# EAGLE design Nakaya Schematic4-handrouting (EAGLE 9.6.2)
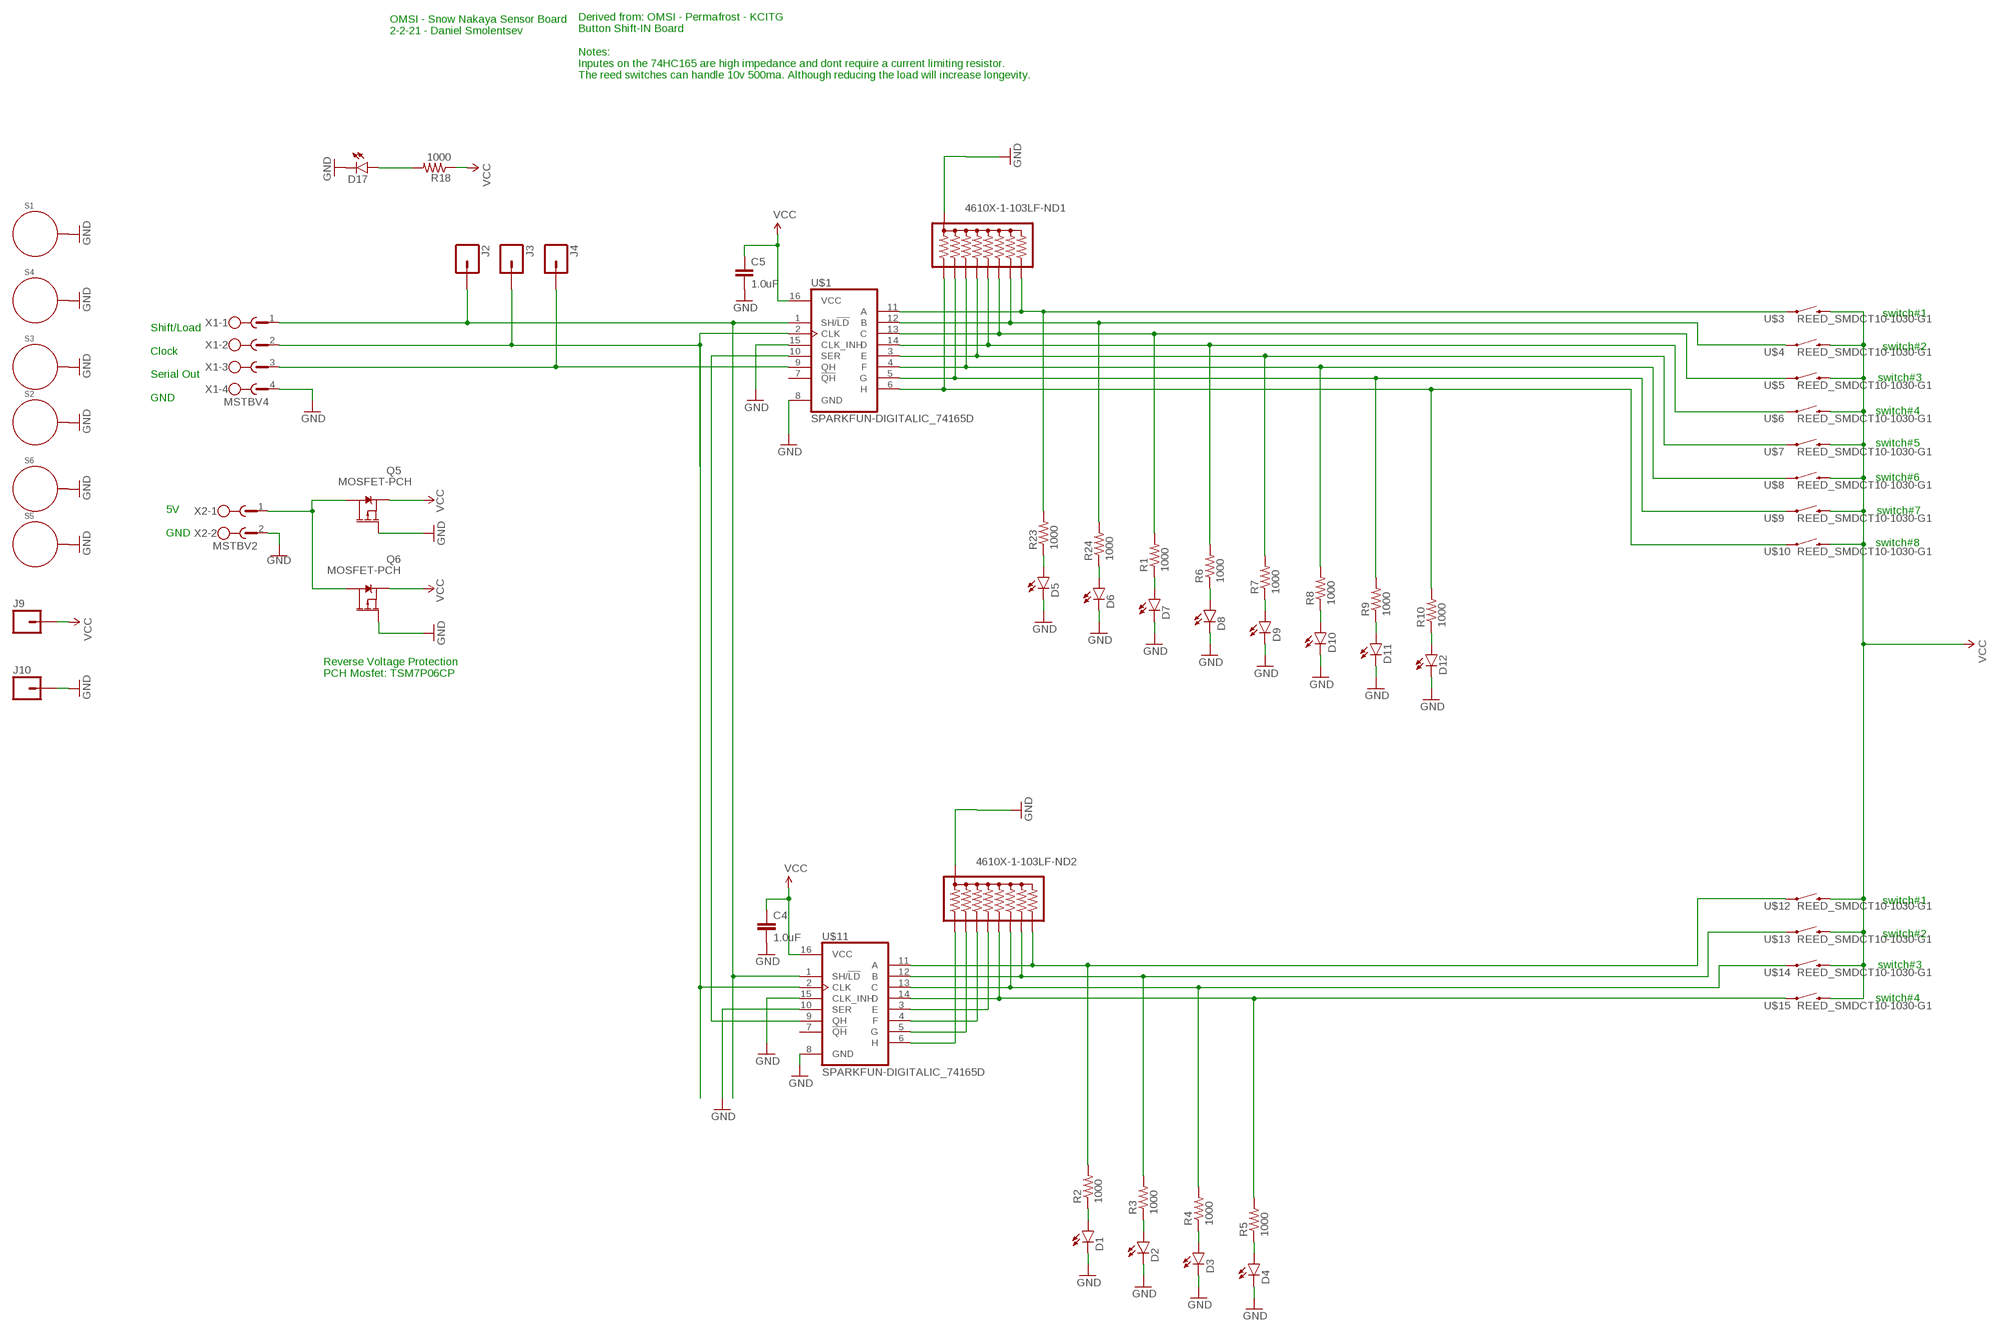
[diagram p0: schematic, sheet 1]

## Parts
4610X-1-103LF-ND1  RPACK-BUSSED-8-SIP-PTH-8  [RPACK-SIP-PTH-8]
4610X-1-103LF-ND2  RPACK-BUSSED-8-SIP-PTH-8  [RPACK-SIP-PTH-8]
C4  1.0uF  SPARKFUN-CAPACITORS_1.0UF-0805-25V-10%  [SPARKFUN-CAPACITORS_0805]
C5  1.0uF  SPARKFUN-CAPACITORS_1.0UF-0805-25V-10%  [SPARKFUN-CAPACITORS_0805]
D1  SPARKFUN-LED_LED1206  [SPARKFUN-LED_LED-1206]
D2  SPARKFUN-LED_LED1206  [SPARKFUN-LED_LED-1206]
D3  SPARKFUN-LED_LED1206  [SPARKFUN-LED_LED-1206]
D4  SPARKFUN-LED_LED1206  [SPARKFUN-LED_LED-1206]
D5  SPARKFUN-LED_LED1206  [SPARKFUN-LED_LED-1206]
D6  SPARKFUN-LED_LED1206  [SPARKFUN-LED_LED-1206]
D7  SPARKFUN-LED_LED1206  [SPARKFUN-LED_LED-1206]
D8  SPARKFUN-LED_LED1206  [SPARKFUN-LED_LED-1206]
D9  SPARKFUN-LED_LED1206  [SPARKFUN-LED_LED-1206]
D10  SPARKFUN-LED_LED1206  [SPARKFUN-LED_LED-1206]
D11  SPARKFUN-LED_LED1206  [SPARKFUN-LED_LED-1206]
D12  SPARKFUN-LED_LED1206  [SPARKFUN-LED_LED-1206]
D17  SPARKFUN-LED_LED1206  [SPARKFUN-LED_LED-1206]
J2  SPARKFUN-CONNECTORS_M01PTH_NO_SILK_YES_STOP  [SPARKFUN-CONNECTORS_1X01_NO_SILK]
J3  SPARKFUN-CONNECTORS_M01PTH_NO_SILK_YES_STOP  [SPARKFUN-CONNECTORS_1X01_NO_SILK]
J4  SPARKFUN-CONNECTORS_M01PTH_NO_SILK_YES_STOP  [SPARKFUN-CONNECTORS_1X01_NO_SILK]
J9  SPARKFUN-CONNECTORS_M01PTH_NO_SILK_YES_STOP  [SPARKFUN-CONNECTORS_1X01_NO_SILK]
J10  SPARKFUN-CONNECTORS_M01PTH_NO_SILK_YES_STOP  [SPARKFUN-CONNECTORS_1X01_NO_SILK]
Q5  MOSFET-PCH  [DPAK]
Q6  MOSFET-PCH  [DPAK]
R1  1000  SPARKFUN-PASSIVES_RESISTOR0805-RES  [SPARKFUN-PASSIVES_0805:1]
R2  1000  SPARKFUN-PASSIVES_RESISTOR0805-RES  [SPARKFUN-PASSIVES_0805:1]
R3  1000  SPARKFUN-PASSIVES_RESISTOR0805-RES  [SPARKFUN-PASSIVES_0805:1]
R4  1000  SPARKFUN-PASSIVES_RESISTOR0805-RES  [SPARKFUN-PASSIVES_0805:1]
R5  1000  SPARKFUN-PASSIVES_RESISTOR0805-RES  [SPARKFUN-PASSIVES_0805:1]
R6  1000  SPARKFUN-PASSIVES_RESISTOR0805-RES  [SPARKFUN-PASSIVES_0805:1]
R7  1000  SPARKFUN-PASSIVES_RESISTOR0805-RES  [SPARKFUN-PASSIVES_0805:1]
R8  1000  SPARKFUN-PASSIVES_RESISTOR0805-RES  [SPARKFUN-PASSIVES_0805:1]
R9  1000  SPARKFUN-PASSIVES_RESISTOR0805-RES  [SPARKFUN-PASSIVES_0805:1]
R10  1000  SPARKFUN-PASSIVES_RESISTOR0805-RES  [SPARKFUN-PASSIVES_0805:1]
R18  1000  SPARKFUN-PASSIVES_RESISTOR0805-RES  [SPARKFUN-PASSIVES_0805:1]
R23  1000  SPARKFUN-PASSIVES_RESISTOR0805-RES  [SPARKFUN-PASSIVES_0805:1]
R24  1000  SPARKFUN-PASSIVES_RESISTOR0805-RES  [SPARKFUN-PASSIVES_0805:1]
S1  STANDOFF_ELECTRICAL.18"  [STANDOFF_ELECTRIC_#8_OVERSIZED]
S2  STANDOFF_ELECTRICAL.18"  [STANDOFF_ELECTRIC_#8_OVERSIZED]
S3  STANDOFF_ELECTRICAL.18"  [STANDOFF_ELECTRIC_#8_OVERSIZED]
S4  STANDOFF_ELECTRICAL.18"  [STANDOFF_ELECTRIC_#8_OVERSIZED]
S5  STANDOFF_ELECTRICAL.18"  [STANDOFF_ELECTRIC_#8_OVERSIZED]
S6  STANDOFF_ELECTRICAL.18"  [STANDOFF_ELECTRIC_#8_OVERSIZED]
U$1  SPARKFUN-DIGITALIC_74165D  [SPARKFUN-DIGITALIC_SO16]
U$3  REED_SMDCT10-1030-G1  [REED_SMD_2]
U$4  REED_SMDCT10-1030-G1  [REED_SMD_2]
U$5  REED_SMDCT10-1030-G1  [REED_SMD_2]
U$6  REED_SMDCT10-1030-G1  [REED_SMD_2]
U$7  REED_SMDCT10-1030-G1  [REED_SMD_2]
U$8  REED_SMDCT10-1030-G1  [REED_SMD_2]
U$9  REED_SMDCT10-1030-G1  [REED_SMD_2]
U$10  REED_SMDCT10-1030-G1  [REED_SMD_2]
U$11  SPARKFUN-DIGITALIC_74165D  [SPARKFUN-DIGITALIC_SO16]
U$12  REED_SMDCT10-1030-G1  [REED_SMD_2]
U$13  REED_SMDCT10-1030-G1  [REED_SMD_2]
U$14  REED_SMDCT10-1030-G1  [REED_SMD_2]
U$15  REED_SMDCT10-1030-G1  [REED_SMD_2]
X1  MSTBV4  [MSTBV4]
X2  MSTBV2  [MSTBV2]

## Nets
CLK: J3.1 U$1.2(CLK) U$11.2(CLK) X1.2
GND: 4610X-1-103LF-ND1.P$1 4610X-1-103LF-ND2.P$1 C4.2 C5.2 D1.C D2.C D3.C D4.C D5.C D6.C D7.C D8.C D9.C D10.C D11.C D12.C D17.C J10.1 Q5.1(G) Q6.1(G) S1.P$1 S2.P$1 S3.P$1 S4.P$1 S5.P$1 S6.P$1 U$1.8(GND) U$1.15(CLK_INH) U$11.8(GND) U$11.10(SER) U$11.15(CLK_INH) X1.4 X2.2
LD: J2.1 U$1.1(SH/!LD) U$11.1(SH/!LD) X1.1
N$1: 4610X-1-103LF-ND2.P$7 R4.2 U$11.13(C) U$14.3
N$2: 4610X-1-103LF-ND2.P$6 R5.2 U$11.14(D) U$15.3
N$3: D17.A R18.2
N$4: 4610X-1-103LF-ND1.P$4 R8.2 U$1.4(F) U$8.3
N$5: Q5.4(D) Q6.4(D) X2.1
N$7: 4610X-1-103LF-ND1.P$3 R9.2 U$1.5(G) U$9.3
N$8: 4610X-1-103LF-ND1.P$2 R10.2 U$1.6(H) U$10.3
N$9: D5.A R23.1
N$11: 4610X-1-103LF-ND2.P$8 R3.2 U$11.12(B) U$13.3
N$14: D7.A R1.1
N$15: D6.A R24.1
N$16: D1.A R2.1
N$17: D8.A R6.1
N$18: D2.A R3.1
N$19: 4610X-1-103LF-ND2.P$9 R2.2 U$11.11(A) U$12.3
N$20: D3.A R4.1
N$21: D4.A R5.1
N$22: D9.A R7.1
N$24: 4610X-1-103LF-ND2.P$5 U$11.3(E)
N$26: 4610X-1-103LF-ND2.P$4 U$11.4(F)
N$27: 4610X-1-103LF-ND2.P$3 U$11.5(G)
N$28: D10.A R8.1
N$29: 4610X-1-103LF-ND2.P$2 U$11.6(H)
N$33: D11.A R9.1
N$36: D12.A R10.1
N$111: 4610X-1-103LF-ND1.P$9 R23.2 U$1.11(A) U$3.3
N$114: 4610X-1-103LF-ND1.P$8 R24.2 U$1.12(B) U$4.3
N$117: 4610X-1-103LF-ND1.P$7 R1.2 U$1.13(C) U$5.3
N$120: 4610X-1-103LF-ND1.P$6 R6.2 U$1.14(D) U$6.3
N$123: 4610X-1-103LF-ND1.P$5 R7.2 U$1.3(E) U$7.3
QH: J4.1 U$1.9(QH) X1.3
SER: U$1.10(SER) U$11.9(QH)
VCC: C4.1 C5.1 J9.1 Q5.3(S) Q6.3(S) R18.1 U$1.16(VCC) U$3.4 U$4.4 U$5.4 U$6.4 U$7.4 U$8.4 U$9.4 U$10.4 U$11.16(VCC) U$12.4 U$13.4 U$14.4 U$15.4
Unconnected: U$1.7(!QH) U$11.7(!QH)

## Notes on the sheet
- OMSI - Snow Nakaya Sensor Board
  2-2-21 - Daniel Smolentsev
- Derived from: OMSI - Permafrost - KCITG
  Button Shift-IN Board
  
  Notes:
  Inputes on the 74HC165 are high impedance and dont require a current limiting resistor.
  The reed switches can handle 10v 500ma. Although reducing the load will increase longevity.
- switch#1
- switch#2
- switch#3
- Shift/Load
  
  Clock
  
  Serial Out
  
  GND
- switch#4
- switch#5
- switch#6
- switch#7
- 5V
  
  GND
- switch#8
- Reverse Voltage Protection
  PCH Mosfet: TSM7P06CP
- switch#1
- switch#2
- switch#3
- switch#4

## Library data of the parts
4610X-1-103LF-ND1 4610X-1-103LF-ND2 = th_libraries:RPACK-BUSSED-8: BOURNS 4600X/R series thick-film SIP resistor packs Height resistors bussed to a single pin (denoted by dot). datasheet <http://dlnmh9ip6v2uc.cloudfront.net/datasheets/Components/General/4600x.pdf> SIMILAR TO: SFE parts COM-10855 (330), COM-10856 (10K)
C4 C5 = th_libraries:SPARKFUN-CAPACITORS_1.0UF: 1µF ceramic capacitors A capacitor is a passive two-terminal electrical component used to store electrical energy temporarily in an electric field.; PROD_ID: CAP-08064
D1-D12 D17 = th_libraries:SPARKFUN-LED_LED: LED (Generic) Standard schematic elements and footprints for 5mm, 3mm, 1206, and 0603 sized LEDs. Generic LEDs with no color specified.
J2-J4 J9 J10 = th_libraries:SPARKFUN-CONNECTORS_M01: Header 1 Standard 1-pin 0.1" header. Use with straight break away headers (SKU : PRT-00116), right angle break away headers (PRT-00553), swiss pins (PRT-00743), machine pins (PRT-00117), and female headers (PRT-00115). SMTSO-256-ET is a "flush mount" nut for a 4-40 screw. The older package used to be too tight, and did not allow it to sit properly thru the drill hit. The latest (0.165DIA) fits nice and snug.
Q5 Q6 = th_libraries:MOSFET-PCH: MOSFET-PCH
R1-R10 R18 R23 R24 = th_libraries:SPARKFUN-PASSIVES_RESISTOR: Resistor Basic schematic elements and footprints for 0603, 1206, and PTH resistors.
S1-S6 = th_libraries:STANDOFF_ELECTRICAL: A standoff intended to be an electrically connected point. Pad size and stop size allow for a #8 Phillips pan screw head to make a solid connection to the board. Added 144mill drill hole that fits my normal wood screw
U$1 U$11 = th_libraries:SPARKFUN-DIGITALIC_74*165
U$3-U$10 U$12-U$15 = th_libraries:REED_SMD: lots of SMD reed switches are around 0.75" long CT10-1030-G1 variant is 0.64 long and 0.08 wide.
X1 = th_libraries:MSTBV4: PHOENIX; MPN: MSTBV 2,5/4-GF-5.08; OC_FARNELL: 1792794; OC_NEWARK: 69R9847
X2 = th_libraries:MSTBV2: PHOENIX; MPN: MSTBV 2,5/2-GF-5.08; OC_FARNELL: 1792792; OC_NEWARK: 69R9845

## Board
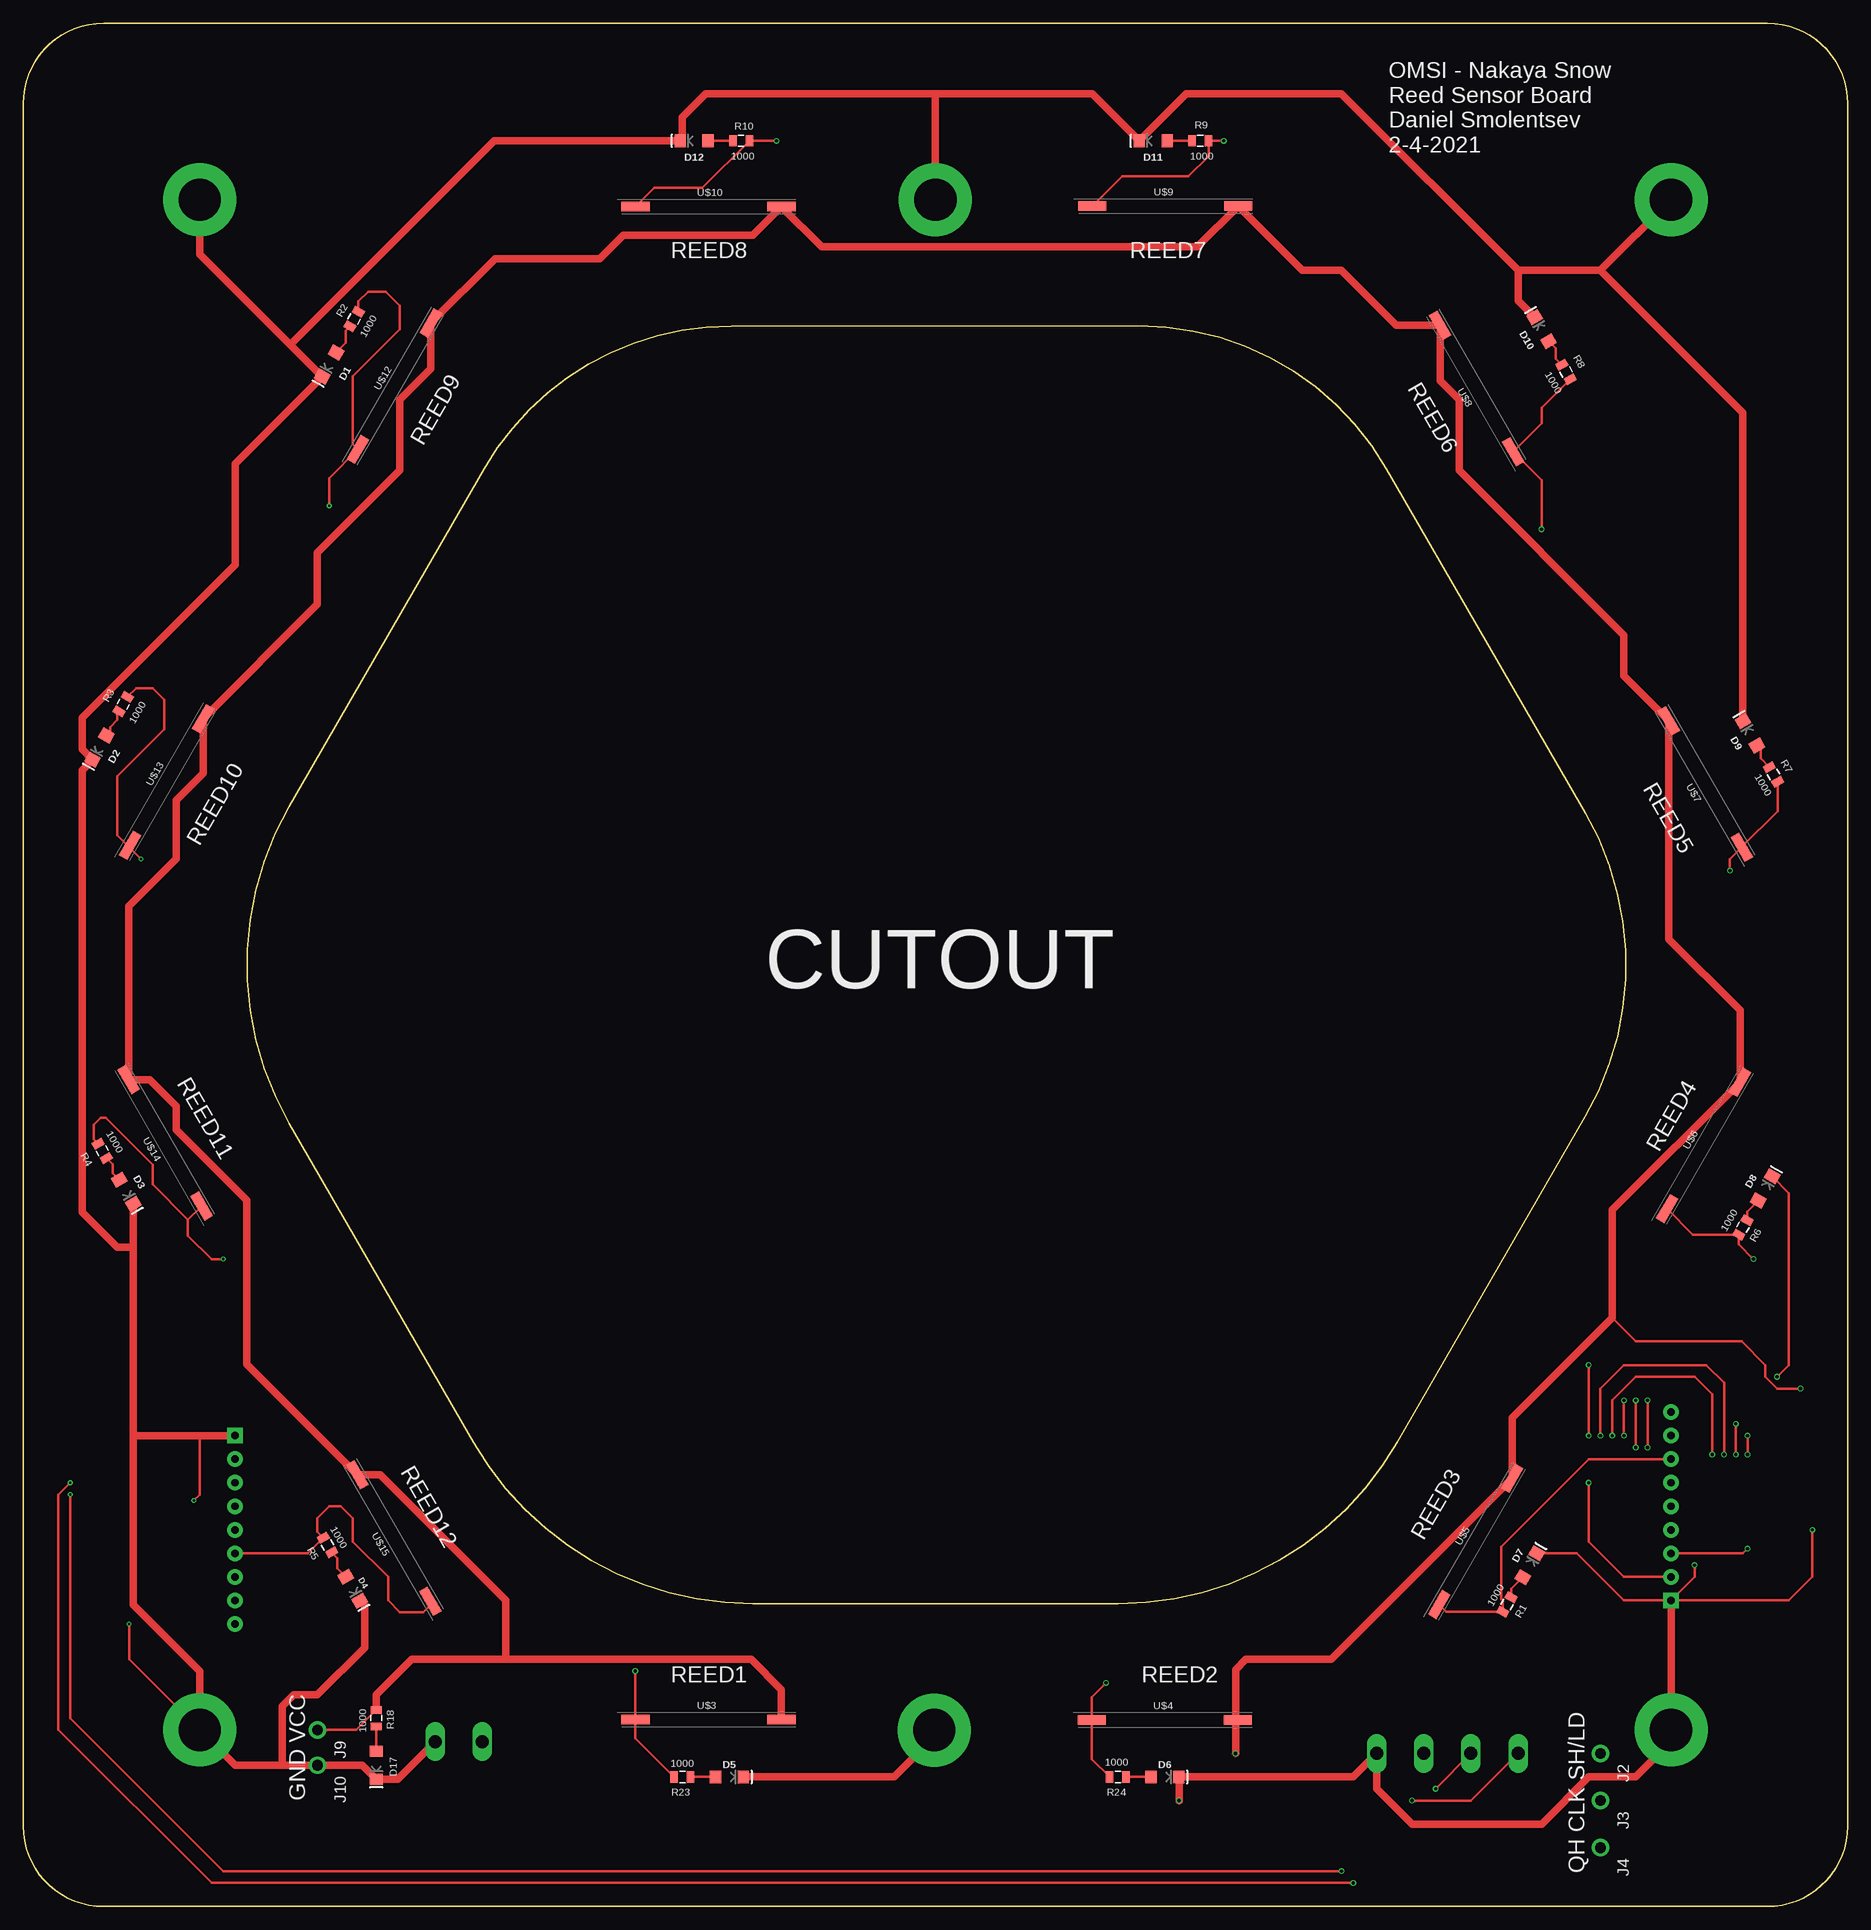
[diagram p1: board, top side]
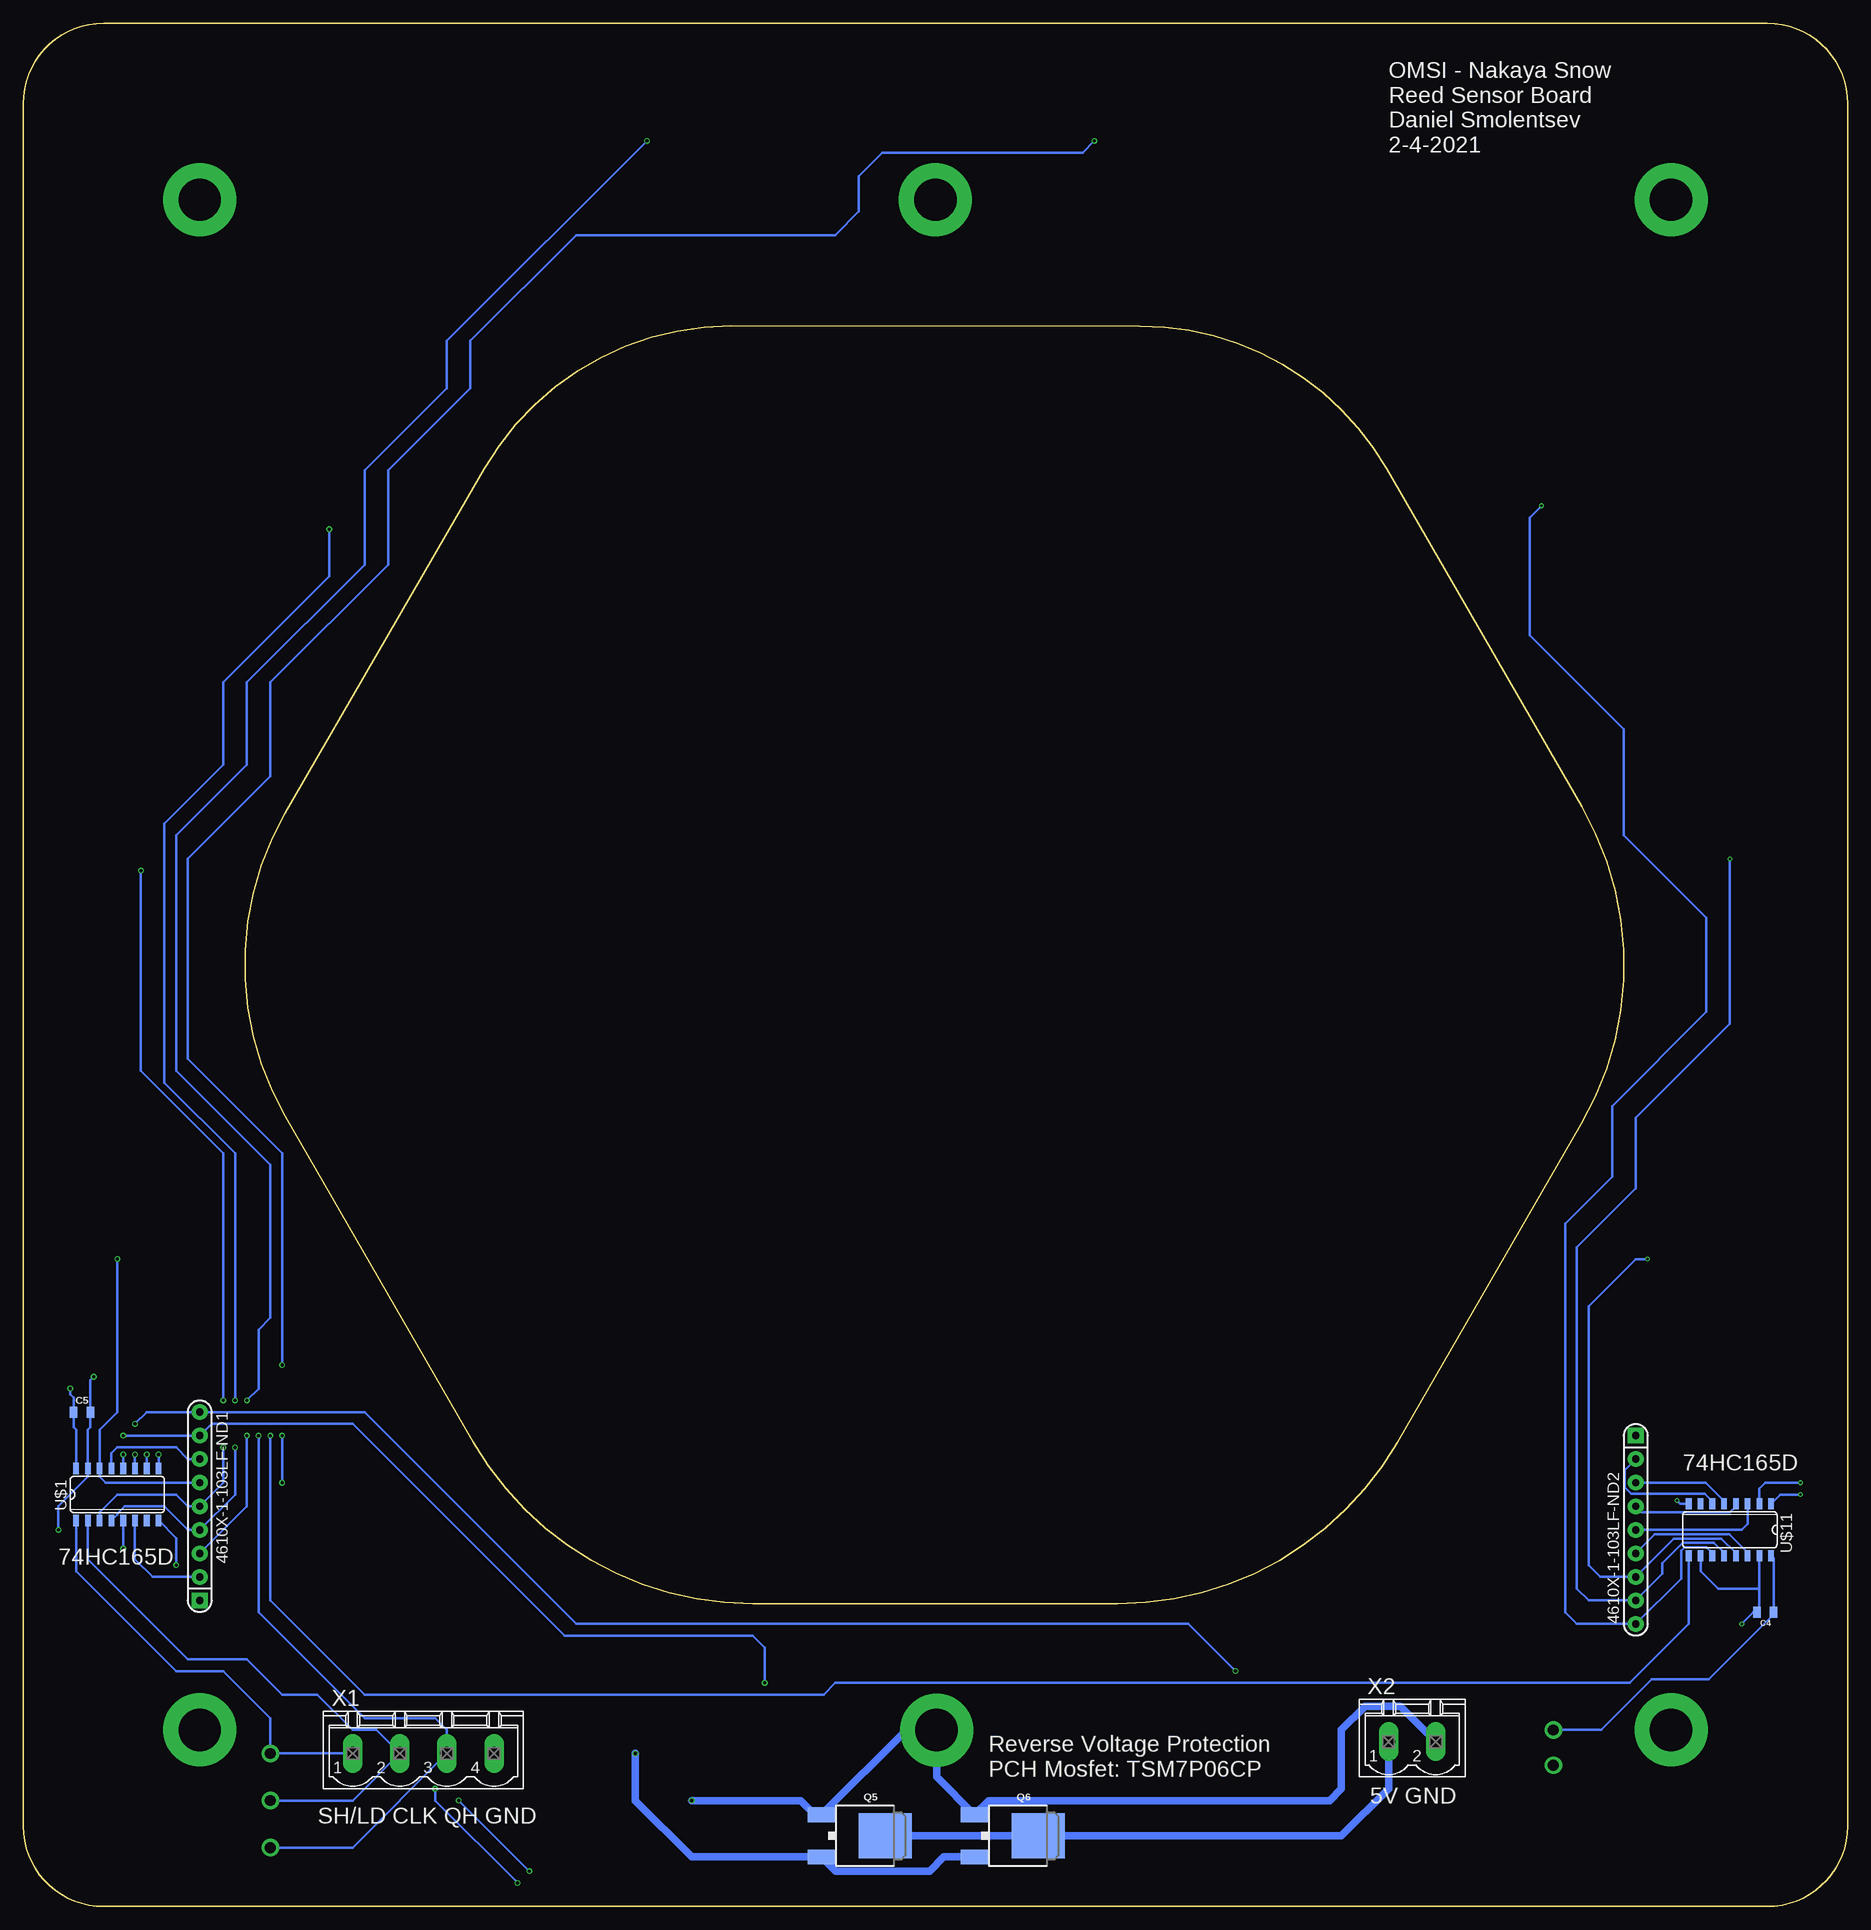
[diagram p2: board, bottom side, seen from below]

Size 196.85 x 203.2 mm. Coordinates in mm from the lower left corner, seen from the top.
Outline: 168.56,85.23 148.28,50.09 arc-60 118.15,32.68 78.74,32.67 arc-60 48.6,50.06 28.72,84.47 arc-60 28.71,118.69 49.73,155.12 arc-60 76.39,170.52 120.43,170.53 arc-60 147.09,155.15 168.55,118 arc-60 168.56,85.23
Outline: 188.18,0 8.67,0 arc-90 0,8.67 0,194.53 arc-90 8.67,203.2 188.18,203.2 arc-90 196.85,194.53 196.85,8.67 arc-90 188.18,0
Copper layers (1*16): Top 0.035559375mm / dielectric 1.6mm / Bottom 0.035559375mm
Design rules "oshpark-2layer_8mil": minimum track width 8mil, minimum drill 10mil, track to track 8mil, track to pad 8mil, pad to pad 8mil, via to via 8mil, smd to smd 8mil, copper to edge 15mil, drill to drill 8mil, minimum pad ring 5mil, minimum via ring 5mil, stop-mask expansion 2.5mil, vias tented up to drill 0mil, thermal gap 10mil

### Footprints (pad centres in the part's own frame; a part is rotated, then mirrored left to right if it is on the bottom)
RPACK-SIP-PTH-8 = drill 0.8 pad 1.676 square: P$1 0,0 | drill 0.8 pad 1.676: P$2 0,-2.54; P$3 0,-5.08; P$4 0,-7.62; P$5 0,-10.16; P$6 0,-12.7; P$7 0,-15.24; P$8 0,-17.78; P$9 0,-20.32
SPARKFUN-CAPACITORS_0805 = smd 0.8 x 1.2: 1 -0.9,0; 2 0.9,0
SPARKFUN-LED_LED-1206 = smd 1.2 x 1.4: A -1.5,0; C 1.5,0
SPARKFUN-CONNECTORS_1X01_NO_SILK = drill 1.168 pad 1.88: 1 0,0
DPAK = smd 1.6 x 3: 1 -2.28,-5.31; 3 2.28,-5.31 | smd 4.826 x 5.715: 4 0,1.588
SPARKFUN-PASSIVES_0805:1 = smd 0.8 x 1.2: 1 -0.9,0; 2 0.9,0
STANDOFF_ELECTRIC_#8_OVERSIZED = drill 4.572 pad 7.874: P$1 0,0
SPARKFUN-DIGITALIC_SO16 = smd 0.6 x 1.2: 1 -4.445,-2.8; 2 -3.175,-2.8; 3 -1.905,-2.8; 4 -0.635,-2.8; 5 0.635,-2.8; 6 1.905,-2.8; 7 3.175,-2.8; 8 4.445,-2.8; 9 4.445,2.8; 10 3.175,2.8; 11 1.905,2.8; 12 0.635,2.8; 13 -0.635,2.8; 14 -1.905,2.8; 15 -3.175,2.8; 16 -4.445,2.8
REED_SMD_2 = smd 3.048 x 1.016: 3 -7.877,0; 4 7.877,0
MSTBV4 = drill 1.397 long: 1 -7.62,0; 2 -2.54,0; 3 2.54,0; 4 7.62,0
MSTBV2 = drill 1.397 long: 1 -2.54,0; 2 2.54,0

### Placement (x,y rotation side)
4610X-1-103LF-ND1  177.8,33.02 180 bottom
4610X-1-103LF-ND2  22.86,50.8 0 bottom
C4  8.89,31.75 180 bottom
C5  190.5,53.34 0 bottom
D1  33.02,166.37 240 top
D2  8.23,125.04 240 top
D3  11.13,77.11 300 top
D4  35.56,34.29 300 top
D5  76.2,13.97 0 top
D6  123.19,13.97 0 top
D7  162.56,36.83 60 top
D8  187.96,77.47 60 top
D9  186.31,126.57 120 top
D10  163.83,170.18 120 top
D11  121.92,190.5 180 top
D12  72.39,190.5 180 top
D17  38.1,15.24 270 top
J2  170.18,16.51 270 top
J3  170.18,11.43 270 top
J4  170.18,6.35 270 top
J9  31.75,19.05 270 top
J10  31.75,15.24 270 top
Q5  105.41,7.62 270 bottom
Q6  88.9,7.62 270 bottom
R1  160.1,32.59 240 top
R2  35.71,171.27 60 top
R3  10.79,129.72 60 top
R4  8.53,81.53 120 top
R5  32.84,38.99 120 top
R6  185.55,73.28 240 top
R7  188.85,122.15 300 top
R8  166.47,165.56 300 top
R9  127,190.5 0 top
R10  77.47,190.5 0 top
R18  38.1,20.32 270 top
R23  71.12,13.97 180 top
R24  118.11,13.97 180 top
S1  177.8,19.05 0 top
S2  19.05,19.05 0 top
S3  98.3,19.02 0 top
S4  98.42,184.15 0 top
S5  19.05,184.15 0 top
S6  177.8,184.15 0 top
U$1  186.69,44.45 0 bottom
U$3  73.94,20.17 0 top
U$4  123.16,20.14 0 top
U$5  156.72,39.4 60 top
U$6  181.31,82.12 60 top
U$7  181.51,121.11 120 top
U$8  156.82,163.78 120 top
U$9  123.22,183.46 0 top
U$10  73.94,183.41 0 top
U$11  12.7,40.64 180 bottom
U$12  40.06,164.03 60 top
U$13  15.47,121.34 60 top
U$14  15.32,82.4 120 top
U$15  40.01,39.75 120 top
X1  153.67,16.51 0 bottom
X2  46.99,17.78 0 bottom

### Tracks (layer width: path | path; a pad name or v marks a point on that pad's centre or on a via)
CLK  (via drill 0.25, 0.35)
  Top 0.254: v143.51,2.54 20.32,2.54 3.81,19.05 3.81,44.45 v5.08,45.72 | X1.2 v152.4,12.7
  Bottom 0.254: U$1.2 189.87,37.47 179.07,26.67 172.72,26.67 168.91,22.86 165.1,22.86 161.29,19.05 158.75,19.05 X1.2 161.29,11.43 J3.1 | v5.08,45.72 8.89,45.72 9.53,45.09 U$11.2 | v152.4,12.7 152.4,11.43 v143.51,2.54
GND  (via drill 0.25, 0.35)
  Top 0.254: 4610X-1-103LF-ND1.P$1 172.72,33.02 167.61,38.13 D7.C | D8.C 190.5,76.98 190.5,58.42 v189.23,57.15 | 4610X-1-103LF-ND1.P$1 180.34,35.56 v180.34,36.83 | v193.04,40.64 193.04,35.56 190.5,33.02 4610X-1-103LF-ND1.P$1 | v18.41,43.81 19.05,44.45 19.05,50.8 4610X-1-103LF-ND2.P$1 | S2.P$1 11.43,26.67 v11.43,30.48
  Top 0.813: 4610X-1-103LF-ND1.P$1 S1.P$1 177.8,17.78 173.99,13.97 168.91,13.97 163.83,8.89 149.86,8.89 146.05,12.7 X1.4 143.51,13.97 D6.C 124.71,13.95 v124.71,11.43 | D5.C 93.98,13.97 98.3,18.29 S3.P$1 | 27.94,15.24 J10.1 36.6,15.24 D17.C 40.41,13.74 X2.2 | 27.94,15.24 22.86,15.24 S2.P$1 19.05,25.4 11.88,32.58 11.88,50.8 | 11.88,50.8 11.88,71.12 | 11.88,71.12 10.16,71.12 6.35,74.93 6.35,122.62 D2.C | 28.82,168.52 D1.C 22.86,155.66 22.86,144.78 6.35,128.27 6.35,124.88 D2.C | 28.82,168.52 19.05,178.29 S5.P$1 | 28.82,168.52 50.8,190.5 D12.C 71.12,190.73 71.12,193.04 73.66,195.58 98.42,195.58 | 98.42,195.58 115.34,195.58 D11.C 125.5,195.58 142.24,195.58 161.29,176.53 | S4.P$1 98.42,195.58 | D10.C 161.29,173.27 161.29,176.53 | 161.29,176.53 170.18,176.53 | 170.18,176.53 S6.P$1 | 170.18,176.53 185.56,161.15 D9.C | D4.C 36.83,32.47 36.83,27.94 31.75,22.86 29.21,22.86 27.94,21.59 27.94,15.24 | 4610X-1-103LF-ND2.P$1 11.88,50.8 | D3.C 11.88,71.12 | D2.C
  Bottom 0.254: v189.23,57.15 189.6,56.78 C5.2 189.6,51.7 189.87,51.44 U$1.15 189.87,46.35 193.04,43.18 v193.04,40.64 | U$1.8 180.34,39.74 v180.34,36.83 | Q5.1 111.42,9.9 | U$11.15 9.53,34.29 | 9.53,34.29 9.53,32.02 C4.2 10.16,31.75 v11.43,30.48 | 9.53,34.29 13.97,34.29 15.88,36.2 U$11.10 | U$11.8 18.04,43.44 v18.41,43.81
  Bottom 0.813: Q5.1 101.59,19.02 S3.P$1 98.3,13.99 Q6.1 92.68,11.43 55.88,11.43 54.61,12.7 54.61,19.05 52.07,21.59 48.26,21.59 X2.2 | 111.42,9.9 112.94,11.42 124.7,11.42 v124.71,11.43
LD  (via drill 0.25, 0.35)
  Top 0.254: v5.08,44.45 5.08,20.32 21.59,3.81 v142.24,3.81 | X1.1 156.21,11.43 v149.86,11.43
  Bottom 0.254: U$1.1 191.13,36.2 180.34,25.4 175.26,25.4 170.18,20.32 J2.1 X1.1 | U$11.1 7.25,44.45 v5.08,44.45 | v149.86,11.43 v142.24,3.81
N$1  (via drill 0.25)
  Top 0.254: v21.59,69.85 20.32,69.85 17.78,72.39 17.78,74.1 | U$14.3 17.78,74.1 | 17.78,74.1 13.97,77.91 13.97,80.01 8.89,85.09 8.38,85.09 7.62,84.33 7.62,82.78 R4.2
  Bottom 0.254: U$11.13 12.06,38.14 13.61,39.69 18.73,39.69 4610X-1-103LF-ND2.P$7 26.67,35.56 27.94,36.83 27.94,64.77 22.86,69.85 v21.59,69.85
N$2
  Top 0.254: 4610X-1-103LF-ND2.P$6 30.72,38.1 R5.2 31.75,40.41 31.75,41.91 33.02,43.18 34.29,43.18 35.56,41.91 35.56,39.37 39.37,35.56 39.37,33.02 40.64,31.75 43.18,31.75 43.94,32.51 U$15.3
  Bottom 0.254: 4610X-1-103LF-ND2.P$6 20.82,40.14 12.8,40.14 10.79,38.14 U$11.14
N$3
  Top 0.254: R18.2 D17.A
N$4  (via drill 0.35)
  Top 0.254: v163.83,148.59 163.83,153.89 U$8.3 163.83,160.03 163.83,161.69 R8.2 | v173.99,54.61 v173.99,49.53
  Bottom 0.254: U$1.4 186.69,42.29 186.69,42.39 185.89,43.18 181.61,43.18 179.07,40.64 4610X-1-103LF-ND1.P$4 173.99,44.45 v173.99,49.53 | v163.83,148.59 163.83,143.51 175.26,132.08 175.26,123.19 181.61,116.84 181.61,88.9 173.99,81.28 v173.99,54.61
N$5
  Bottom 0.813: Q5.4 Q6.4 54.61,7.62 49.53,12.7 X2.1
N$7  (via drill 0.35)
  Top 0.254: 4610X-1-103LF-ND1.P$3 185.55,38.1 v186.06,38.61 | U$9.3 118.56,186.69 125.73,186.69 127.9,188.86 R9.2 v129.54,190.5 | v172.72,50.8 v172.72,54.61
  Bottom 0.254: v186.06,38.61 U$1.5 | 4610X-1-103LF-ND1.P$3 172.72,43.18 v172.72,50.8 | v172.72,54.61 171.45,55.88 171.45,62.23 170.18,63.5 170.18,80.01 180.34,90.17 180.34,115.57 172.72,123.19 172.72,132.08 160.02,144.78 160.02,154.94 151.13,163.83 151.13,168.91 v129.54,190.5
N$8  (via drill 0.35)
  Top 0.254: 4610X-1-103LF-ND1.P$2 172.72,35.56 168.91,39.37 v168.91,45.72 | v168.91,50.8 v168.91,58.42 | v81.28,190.5 R10.2 73.29,185.42 68.07,185.42 U$10.3
  Bottom 0.254: 4610X-1-103LF-ND1.P$2 182.88,35.56 184.78,37.47 U$1.6 | v168.91,45.72 v168.91,50.8 | v168.91,58.42 168.91,81.28 179.07,91.44 179.07,113.03 170.18,121.92 170.18,132.08 157.48,144.78 157.48,154.94 148.59,163.83 148.59,168.91 137.16,180.34 109.22,180.34 106.68,182.88 106.68,186.69 104.14,189.23 82.55,189.23 v81.28,190.5
N$9
  Top 0.254: R23.1 D5.A
N$11  (via drill 0.25)
  Top 0.254: R3.2 12.19,131.44 13.97,131.44 15.24,130.18 15.24,127 10.16,121.92 10.16,115.57 11.22,114.51 U$13.3 11.53,114.2 v12.7,113.03
  Bottom 0.254: U$11.12 13.34,38.14 14.42,39.23 17.77,39.23 19.99,37.01 19.99,35.89 4610X-1-103LF-ND2.P$8 27.94,33.02 29.21,34.29 29.21,71.12 22.86,77.47 22.86,85.09 12.7,95.25 v12.7,113.03
N$14
  Top 0.254: D7.A 160.55,34.27 R1.1
N$15
  Top 0.254: R24.1 D6.A
N$16
  Top 0.254: R2.1 34.8,170.03 34.8,168.7 D1.A
N$17
  Top 0.254: R6.1 186,74.96 D8.A
N$18
  Top 0.254: R3.1 10.16,128.75 10.16,128.02 9.4,127.25 9.4,126.76 D2.A
N$19  (via drill 0.25)
  Top 0.254: v33.02,151.13 33.02,154.11 U$12.3 35.56,157.77 35.56,165.1 40.64,170.18 40.64,172.72 39.12,174.24 37.21,174.24 36.16,173.19 R2.2
  Bottom 0.254: U$11.11 14.61,38.14 15.23,38.77 17.58,38.77 17.96,38.39 17.96,35.38 4610X-1-103LF-ND2.P$9 29.21,30.48 30.48,31.75 30.48,73.66 25.4,78.74 25.4,86.36 15.24,96.52 15.24,106.68 24.13,115.57 24.13,127 34.29,137.16 34.29,149.86 v33.02,151.13
N$20
  Top 0.254: R4.1 9.65,80.09 9.65,79.14 D3.A
N$21
  Top 0.254: R5.1 33.91,37.59 33.91,36.49 D4.A
N$22
  Top 0.254: R7.1 187.45,123.88 187.45,124.88 D9.A
N$24
  Bottom 0.254: 4610X-1-103LF-ND2.P$5 11.43,40.64 10.79,41.27 U$11.3
N$26
  Bottom 0.254: 4610X-1-103LF-ND2.P$4 22.19,42.51 12.7,42.51 12.06,43.14 U$11.4
N$27
  Bottom 0.254: 4610X-1-103LF-ND2.P$3 15.31,45.72 13.34,43.74 U$11.5
N$28
  Top 0.254: R8.1 165.35,167 165.35,168.11 D10.A
N$29
  Bottom 0.254: 4610X-1-103LF-ND2.P$2 24.03,47.09 24.03,45.24 23.34,44.55 15.42,44.55 14.61,43.74 U$11.6
N$33
  Top 0.254: R9.1 D11.A
N$36
  Top 0.254: R10.1 D12.A
N$111  (via drill 0.35)
  Top 0.254: v184.78,48.77 v184.78,52.07 | v66.04,25.4 66.06,25.38 U$3.3 66.06,18.13 R23.2
  Bottom 0.254: U$1.11 v184.78,48.77 | v184.78,52.07 183.51,53.34 4610X-1-103LF-ND1.P$9 160.02,53.34 137.16,30.48 71.12,30.48 v66.04,25.4
N$114  (via drill 0.35)
  Top 0.254: v186.06,50.8 v186.06,48.77 | v116.84,24.13 115.29,22.58 115.29,20.32 U$4.3 115.29,15.89 R24.2
  Bottom 0.254: v186.06,50.8 4610X-1-103LF-ND1.P$8 176.53,52.07 161.29,52.07 138.43,29.21 118.11,29.21 116.84,27.94 v116.84,24.13 | v186.06,48.77 U$1.12
N$117
  Top 0.254: U$5.3 153.54,31.81 R1.2 159.65,33 159.47,33.17 159.47,38.82 168.91,48.26 4610X-1-103LF-ND1.P$7
  Bottom 0.254: 4610X-1-103LF-ND1.P$7 179.07,48.26 180.34,49.53 186.69,49.53 187.32,48.9 U$1.13
N$120  (via drill 0.35)
  Top 0.254: v186.69,69.85 185.1,71.44 R6.2 180.16,72.5 U$6.3
  Bottom 0.254: 4610X-1-103LF-ND1.P$6 187.96,45.72 188.59,46.35 U$1.14 188.59,51.44 186.69,53.34 v186.69,69.85
N$123  (via drill 0.35)
  Top 0.254: v175.26,49.53 v175.26,54.61 | v184.15,111.76 184.15,112.99 U$7.3 185.45,114.33 189.3,118.18 R7.2
  Bottom 0.254: U$1.3 188.59,42.55 186.69,44.45 180.34,44.45 179.07,43.18 4610X-1-103LF-ND1.P$5 175.26,45.72 v175.26,49.53 | v175.26,54.61 175.26,81.28 184.15,90.17 v184.15,111.76
QH  (via drill 0.35)
  Top 0.254: v182.25,48.77 182.25,55.24 180.34,57.15 173.99,57.15 171.45,54.61 v171.45,50.8
  Bottom 0.254: v171.45,50.8 171.45,31.75 160.02,20.32 152.4,20.32 151.13,19.05 X1.3 161.29,6.35 J4.1 | U$1.9 v182.25,48.77
SER  (via drill 0.35)
  Top 0.254: v183.51,48.77 183.51,56.52 181.61,58.42 172.72,58.42 170.18,55.88 v170.18,50.8
  Bottom 0.254: U$1.10 v183.51,48.77 | v170.18,50.8 170.18,33.02 160.02,22.86 110.49,22.86 109.22,24.13 23.5,24.13 17.14,30.48 U$11.9
VCC  (via drill 0.35)
  Top 0.254: 171.45,63.5 173.99,60.96 185.42,60.96 187.96,58.42 187.96,57.15 189.23,55.88 v191.77,55.88 | R18.1 35.93,19.05 J9.1
  Top 0.813: v130.81,16.51 130.81,19.91 U$4.4 130.81,20.37 130.81,25.55 131.93,26.67 141.11,26.67 U$5.4 160.66,52.71 171.45,63.5 171.45,75.15 U$6.4 185.24,96.7 177.57,104.37 U$7.4 172.72,132.78 172.72,137.16 154.94,154.94 154.94,162.56 152.88,164.62 U$8.4 148.17,170.6 142.24,176.53 138.03,176.53 U$9.4 126.7,179.07 86.16,179.07 U$10.4 78.74,180.34 64.77,180.34 62.23,177.8 50.94,177.8 U$12.4 43.99,165.91 40.64,162.56 40.64,154.94 31.75,146.05 31.75,140.5 U$13.4 19.41,122.28 16.51,119.38 16.51,113.03 11.38,107.9 U$14.4 13.65,89.22 16.51,86.36 16.51,83.82 24.13,76.2 24.13,58.51 U$15.4 38.52,46.57 52.07,33.02 52.07,26.67 | U$3.4 81.82,23.4 78.54,26.67 52.07,26.67 | R18.1 38.1,22.86 41.91,26.67 52.07,26.67
  Bottom 0.254: U$1.16 191.13,51.44 191.4,51.7 C5.1 191.4,54.88 191.77,55.24 v191.77,55.88 | U$11.16 7.99,37.58 C4.1 7.99,31.55 15.01,24.53 21.11,24.53 26.59,19.05 J9.1
  Bottom 0.813: Q6.3 97.53,5.34 99.06,3.81 109.19,3.81 Q5.3 124.72,5.34 130.81,11.43 v130.81,16.51

### Text on the board
tNames: OMSI - Nakaya Snow / Reed Sensor Board / Daniel Smolentsev / 2-4-2021 | REED8 | REED7 | REED9 | REED6 | REED10 | REED5 | CUTOUT | REED11 | REED4 | REED12 | REED3 | REED1 | REED2 | GND VCC | QH CLK SH/LD
bNames: OMSI - Nakaya Snow / Reed Sensor Board / Daniel Smolentsev / 2-4-2021 | 74HC165D | 74HC165D | Reverse Voltage Protection / PCH Mosfet: TSM7P06CP | 5V GND | SH/LD CLK QH GND